# Altium schematic sheet Sheet1.SchDoc
size A4; Author: Christian Kieser; Engineer: Christian Kieser
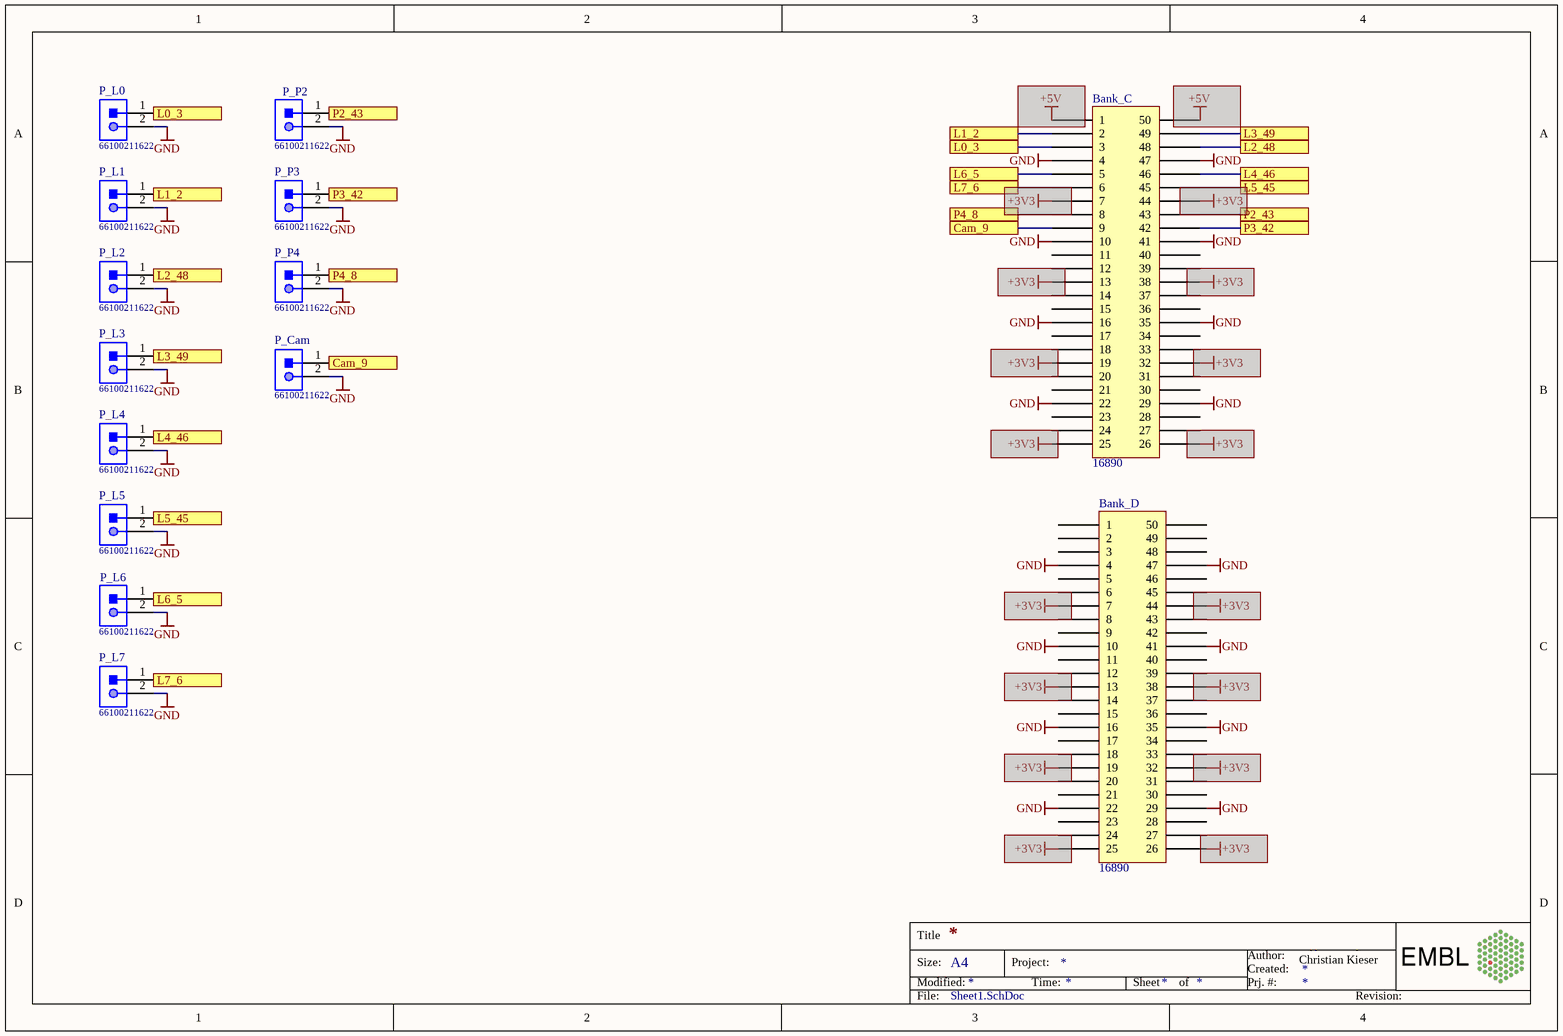
[diagram p0: Sheet1.SchDoc]

## Parts
Bank_C  16890  [SSOP50P500X600-50N]
Bank_D  16890  [SSOP50P500X600-50N]
P_Cam  66100211622  [66100211622]
P_L0  66100211622  [66100211622]
P_L1  66100211622  [66100211622]
P_L2  66100211622  [66100211622]
P_L3  66100211622  [66100211622]
P_L4  66100211622  [66100211622]
P_L5  66100211622  [66100211622]
P_L6  66100211622  [66100211622]
P_L7  66100211622  [66100211622]
P_P2  66100211622  [66100211622]
P_P3  66100211622  [66100211622]
P_P4  66100211622  [66100211622]

## Ports
Cam_9, L0_3, L1_2, L2_48, L3_49, L4_46, L5_45, L6_5, L7_6, P2_43, P3_42, P4_8

## Nets
GND: Bank_C.4 Bank_C.10 Bank_C.16 Bank_C.22 Bank_C.29 Bank_C.35 Bank_C.41 Bank_C.47 Bank_D.4 Bank_D.10 Bank_D.16 Bank_D.22 Bank_D.29 Bank_D.35 Bank_D.41 Bank_D.47 P_Cam.2 P_L0.2 P_L1.2 P_L2.2 P_L3.2 P_L4.2 P_L5.2 P_L6.2 P_L7.2 P_P2.2 P_P3.2 P_P4.2
Cam_9: Bank_C.9 P_Cam.1 ; port Cam_9
L0_3: Bank_C.3 P_L0.1 ; port L0_3
L1_2: Bank_C.2 P_L1.1 ; port L1_2
L2_48: Bank_C.48 P_L2.1 ; port L2_48
L3_49: Bank_C.49 P_L3.1 ; port L3_49
L4_46: Bank_C.46 P_L4.1 ; port L4_46
L5_45: P_L5.1 ; port L5_45
L6_5: Bank_C.5 P_L6.1 ; port L6_5
L7_6: P_L7.1 ; port L7_6
P2_43: P_P2.1 ; port P2_43
P3_42: Bank_C.42 P_P3.1 ; port P3_42
P4_8: P_P4.1 ; port P4_8

Not connected (* = marked no-connect by the designer): Bank_C 1 6 7 8 11 12 13 14 15 17 18 19 20 21 23 24 25 26 27 28 30 31 32 33 34 36 37 38 39 40 43 44 45 50; Bank_D 1 2 3 5 6 7 8 9 11 12 13 14 15 17 18 19 20 21 23 24 25 26 27 28 30 31 32 33 34 36 37 38 39 40 42 43 44 45 46 48 49 50

## Notes on the sheet
- Christian Kieser
- Title
- Size:
- Modified:
- A4
- Project:
- Time:
- Sheet
- of
- Created:
- Author:
- Prj. #:
- Alfons Riedinger
- File:
- Revision:

## Library data of the parts
Bank_C Bank_D = CMP-00541-6: Board to Board Double Slot Femal 50 PIN; Manufacturer: Sparkfun; PartNumber: PRT-16890
P_Cam P_L0-P_L7 P_P2-P_P4 = CMP-001-0161-A.3: WR-WTB 2.54 mm Male Vertical Shrouded Header 2 Pins; Manufacturer: Wurth Electronics; Supplier Part Number: 732-14102-ND; PartNumber: 66100211622; Supplier: Digi-Key